# EAGLE design SFD-V1 (EAGLE 9.5.2)
SFD-V1-Dekoder für Selectrix
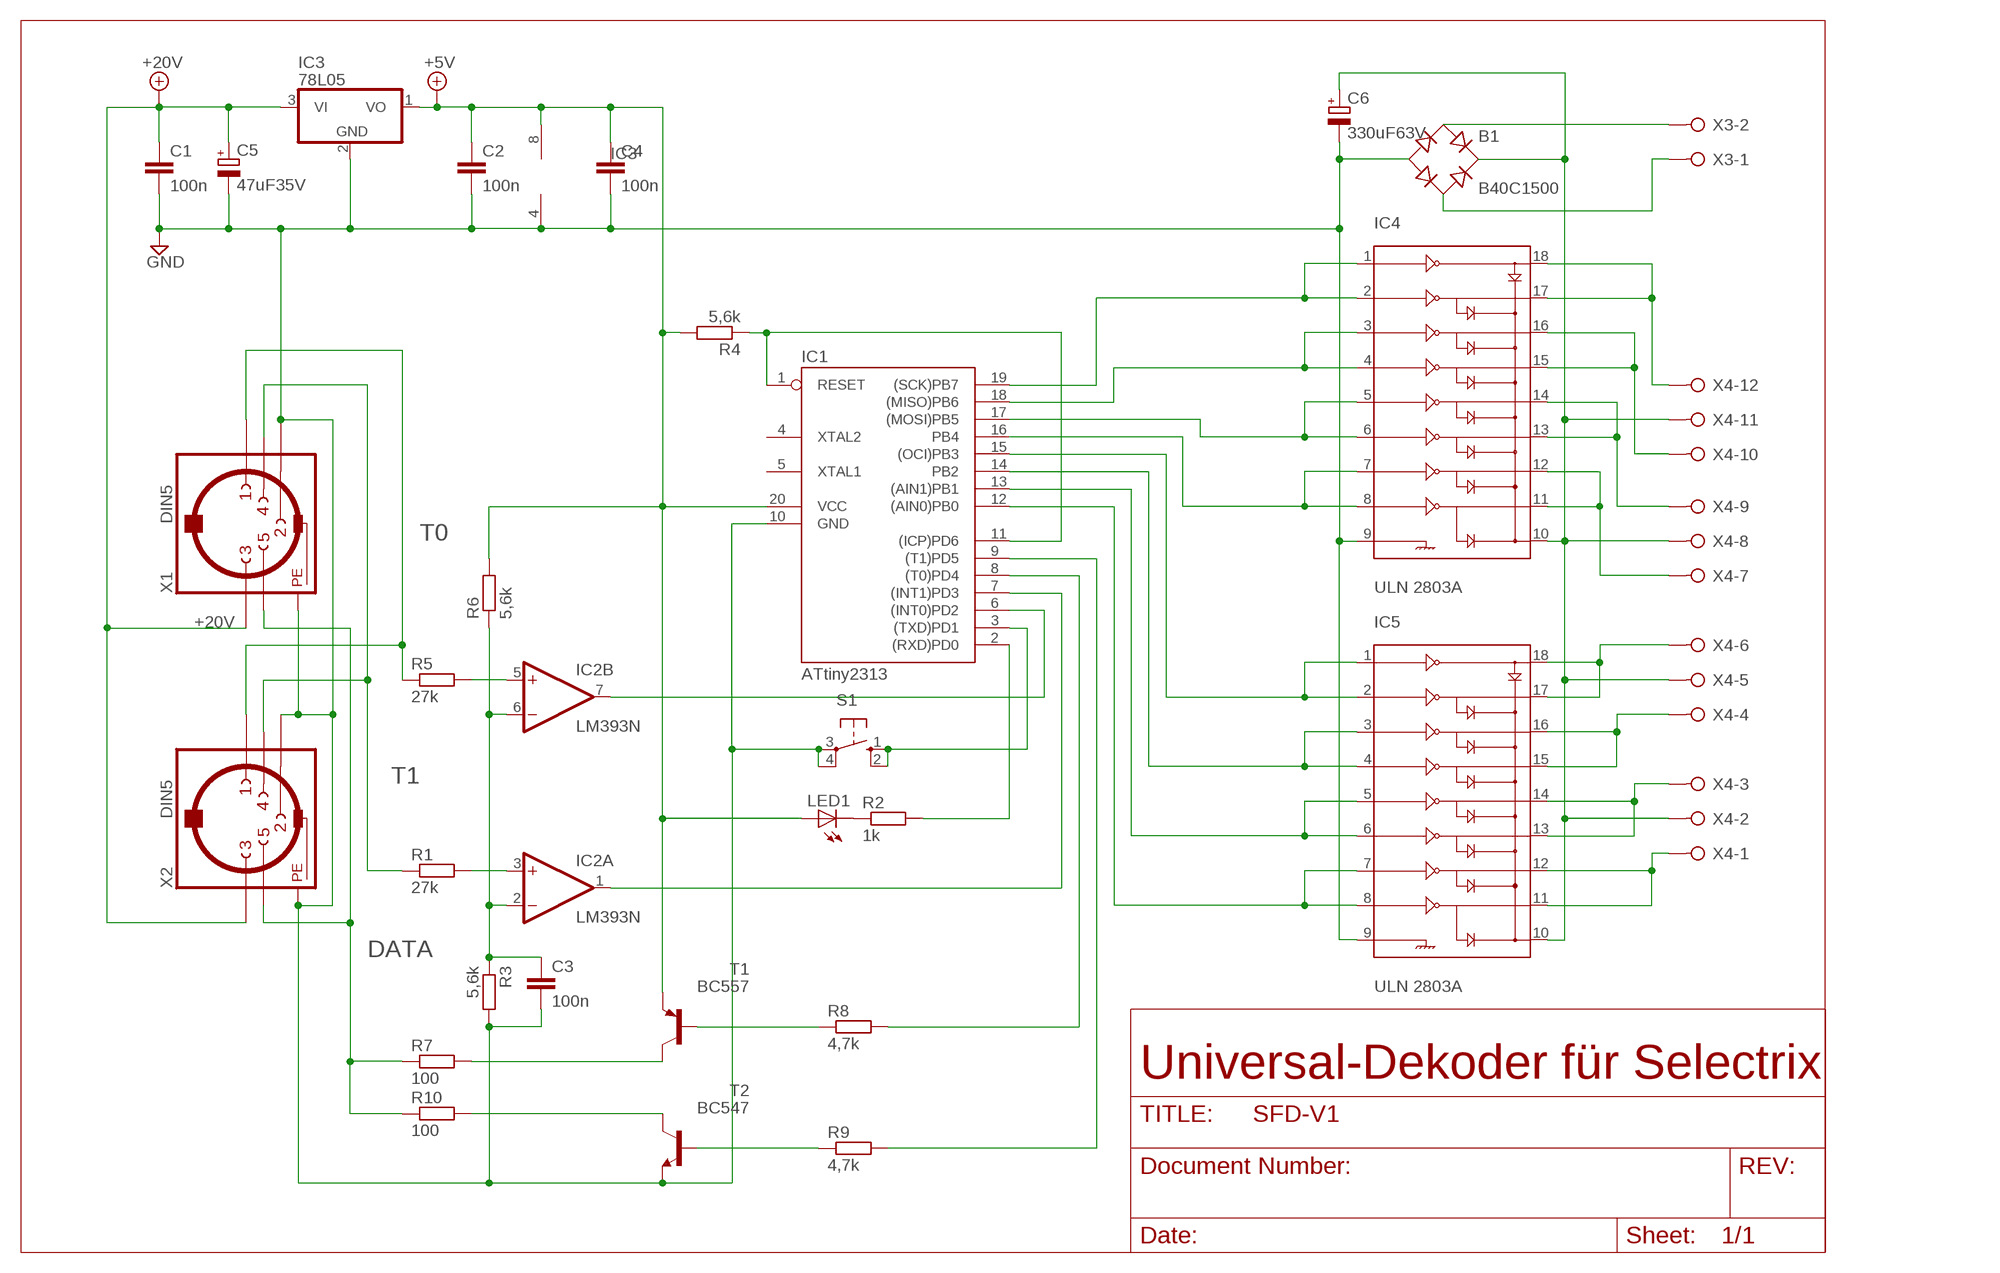
[diagram p0: schematic, sheet 1]

## Parts
B1  B40C1500  RECTIFIER-RB1A  [RB1A]
C1  100n  C-EU025-025X050  [C025-025X050]
C2  100n  C-EU025-025X050  [C025-025X050]
C3  100n  C-EU025-025X050  [C025-025X050]
C4  100n  C-EU025-025X050  [C025-025X050]
C5  47uF35V  CPOL-EUE2,5-6E  [E2,5-6E]
C6  330uF63V  CPOL-EUE5-13  [E5-13]
IC1  ATtiny2313  AT90S2313P  [DIL20]
IC2  LM393N  [DIL08]
IC3  78L05  78L05Z  [TO92]
IC4  ULN 2803A  ULN2803  [DIL18]
IC5  ULN 2803A  ULN2803  [DIL18]
LED1  LED3MM  [LED3MM]
R1  27k  R-EU_0207/10  [0207/10]
R2  1k  R-EU_0207/10  [0207/10]
R3  5,6k  R-EU_0207/10  [0207/10]
R4  5,6k  R-EU_0207/10  [0207/10]
R5  27k  R-EU_0207/10  [0207/10]
R6  5,6k  R-EU_0207/10  [0207/10]
R7  100  R-EU_0207/10  [0207/10]
R8  4,7k  R-EU_0207/10  [0207/10]
R9  4,7k  R-EU_0207/10  [0207/10]
R10  100  R-EU_0207/10  [0207/10]
S1  10-XX  [B3F-10XX]
T1  BC557  [TO92]
T2  BC547  [TO92]
X1  DIN5  CON-HIRSCHMANN_DIN5  [CON-HIRSCHMANN_DIN5]
X2  DIN5  CON-HIRSCHMANN_DIN5  [CON-HIRSCHMANN_DIN5]
X3  W237-02P  [W237-132]
X4  W237-12P  [W237-12P]

## Nets
2-INT0: IC1.6((INT0)PD2) IC2.7(B:OUT)
4: IC1.7((INT1)PD3) IC2.1(A:OUT)
+5V: C2.1 C4.1 IC1.20(VCC) IC2.8(P:V+) IC3.1(VO) LED1.A R4.2 R6.2 T1.1(E)
+20V: C1.1 C5.+ IC3.3(VI) X1.3 X2.3
DATA: R7.1 R10.1 X1.5 X2.5
GND: B1.- C1.2 C2.2 C3.2 C4.2 C5.- C6.- IC1.10(GND) IC2.4(P:V-) IC3.2(GND) IC4.9 IC5.9 R3.2 S1.3(P) S1.4(P1) T2.1(E) X1.2 X1.PE X1.PE1(PE) X1.PE@1(PE) X1.PE@(PE) X2.2 X2.PE X2.PE1(PE) X2.PE@1(PE) X2.PE@(PE)
N$1: IC1.3((TXD)PD1) S1.1(S) S1.2(S1)
N$2: IC1.8((T0)PD4) R8.2
N$3: B1.AC1 X3.2
N$4: IC2.5(B:+IN) R5.2
N$5: IC2.3(A:+IN) R1.2
N$6: LED1.K(C) R2.1
N$7: C3.1 IC2.2(A:-IN) IC2.6(B:-IN) R3.1 R6.1
N$8: IC1.2((RXD)PD0) R2.2
N$9: IC1.1(RESET) IC1.11((ICP)PD6) R4.1
N$10: IC1.12((AIN0)PB0) IC5.7 IC5.8
N$11: IC1.13((AIN1)PB1) IC5.5 IC5.6
N$12: IC1.14(PB2) IC5.3 IC5.4
N$13: R10.2 T2.3(C)
N$14: IC1.15((OCI)PB3) IC5.1 IC5.2
N$15: B1.AC2 X3.1
N$16: R7.2 T1.3(C)
N$17: IC1.16(PB4) IC4.7 IC4.8
N$18: IC1.17((MOSI)PB5) IC4.5 IC4.6
N$19: IC4.17 IC4.18 X4.12
N$20: IC1.19((SCK)PB7) IC4.1 IC4.2
N$21: IC1.18((MISO)PB6) IC4.3 IC4.4
N$22: B1.+ C6.+ IC4.10 IC5.10 X4.2 X4.5 X4.8 X4.11
N$23: IC1.9((T1)PD5) R9.2
N$24: IC4.15 IC4.16 X4.10
N$25: R8.1 T1.2(B)
N$26: IC4.13 IC4.14 X4.9
N$27: R9.1 T2.2(B)
N$28: IC4.11 IC4.12 X4.7
N$30: IC5.17 IC5.18 X4.6
N$32: IC5.15 IC5.16 X4.4
N$34: IC5.13 IC5.14 X4.3
N$36: IC5.11 IC5.12 X4.1
T0: R5.1 X1.1 X2.1
T1: R1.1 X1.4 X2.4
Unconnected: IC1.4(XTAL2) IC1.5(XTAL1)

## Notes on the sheet
- IC3
- Universal-Dekoder für Selectrix

## Library data of the parts
B1 = rectifier:RECTIFIER-: Rectifier
C1-C4 = rcl:C-EU: CAPACITOR, European symbol
C5 = rcl:CPOL-EU: POLARIZED CAPACITOR, European symbol
C6 = rcl:CPOL-EU: POLARIZED CAPACITOR, European symbol; SPICEPREFIX: C
IC1 = atmel:AT90S2313: MICROCONTROLLER 2 Kbytes FLASH 128 bytes SRAM 128 bytes EEPROM UART; OC_FARNELL: unknown; OC_NEWARK: unknown
IC2 = linear3:LM393: COMPARATOR
IC3 = linear3:78*: Positive VOLTAGE REGULATOR Source: http://cache.national.com/ds/LM/LM78L05.pdf http://www.fairchildsemi.com/ds/LM/LM7805.pdf
IC4 IC5 = transistor-arrays-1:ULN2803: ULN2803- Darlington Array Featuring continious load ratings to 500mA for each of the drivers.
LED1 = led:LED: LED OSRAM: - CHIPLED LG R971, LG N971, LY N971, LG Q971, LY Q971, LO R971, LY R971 LH N974, LH R974 LS Q976, LO Q976, LY Q976 LO Q996 - Hyper CHIPLED LW Q18S LB Q993, LB Q99A, LB R99A - SideLED LS A670, LO A670, LY A670, LG A670, LP A670 LB A673, LV A673, LT A673, LW A673 LH A674 LY A675 LS A676, LA A676, LO A676, LY A676, LW A676 LS A679, LY A679, LG A679 - Hyper Micro SIDELED® LS Y876, LA Y876, LO Y876, LY Y876 LT Y87S - SmartLED LW L88C, LW L88S LB L89C, LB L89S, LG L890 LS L89K, LO L89K, LY L89K LS L896, LA L896, LO L896, LY L896 - TOPLED LS T670, LO T670, LY T670, LG T670, LP T670 LSG T670, LSP T670, LSY T670, LOP T670, LYG T670 LG T671, LOG T671, LSG T671 LB T673, LV T673, LT T673, LW T673 LH T674 LS T676, LA T676, LO T676, LY T676, LB T676, LH T676, LSB T676, LW T676 LB T67C, LV T67C, LT T67C, LS T67K, LO T67K, LY T67K, LW E67C LS E67B, LA E67B, LO E67B, LY E67B, LB E67C, LV E67C, LT E67C LW T67C LS T679, LY T679, LG T679 LS T770, LO T770, LY T770, LG T770, LP T770 LB T773, LV T773, LT T773, LW T773 LH T774 LS E675, LA E675, LY E675, LS T675 LS T776, LA T776, LO T776, LY T776, LB T776 LHGB T686 LT T68C, LB T68C - Hyper Mini TOPLED® LB M676 - Mini TOPLED Santana® LG M470 LS M47K, LO M47K, LY M47K Source: http://www.osram.convergy.de LUXEON: - LUMILED® LXK2-PW12-R00, LXK2-PW12-S00, LXK2-PW14-U00, LXK2-PW14-V00 LXK2-PM12-R00, LXK2-PM12-S00, LXK2-PM14-U00 LXK2-PE12-Q00, LXK2-PE12-R00, LXK2-PE12-S00, LXK2-PE14-T00, LXK2-PE14-U00 LXK2-PB12-K00, LXK2-PB12-L00, LXK2-PB12-M00, LXK2-PB14-N00, LXK2-PB14-P00, LXK2-PB14-Q00 LXK2-PR12-L00, LXK2-PR12-M00, LXK2-PR14-Q00, LXK2-PR14-R00 LXK2-PD12-Q00, LXK2-PD12-R00, LXK2-PD12-S00 LXK2-PH12-R00, LXK2-PH12-S00 LXK2-PL12-P00, LXK2-PL12-Q00, LXK2-PL12-R00 Source: www.luxeon.com KINGBRIGHT: KA-3528ASYC Source: www.kingbright.com
R1-R10 = rcl:R-EU_: RESISTOR, European symbol
S1 = switch-omron:10-XX: OMRON SWITCH; MPN: B3F-1000; OC_FARNELL: 176432; OC_NEWARK: 36M3542
T1 = transistor-pnp:BC557: PNP Transistor
T2 = transistor:BC547: NPN TRANSISTOR
X1 X2 = DIN5:CON-HIRSCHMANN_DIN5
X3 = con-wago-508:W237-02P: WAGO SREW CLAMP; OC_FARNELL: unknown; OC_NEWARK: unknown
X4 = con-wago-508:W237-12P: WAGO SREW CLAMP; OC_FARNELL: unknown; OC_NEWARK: unknown

## Board
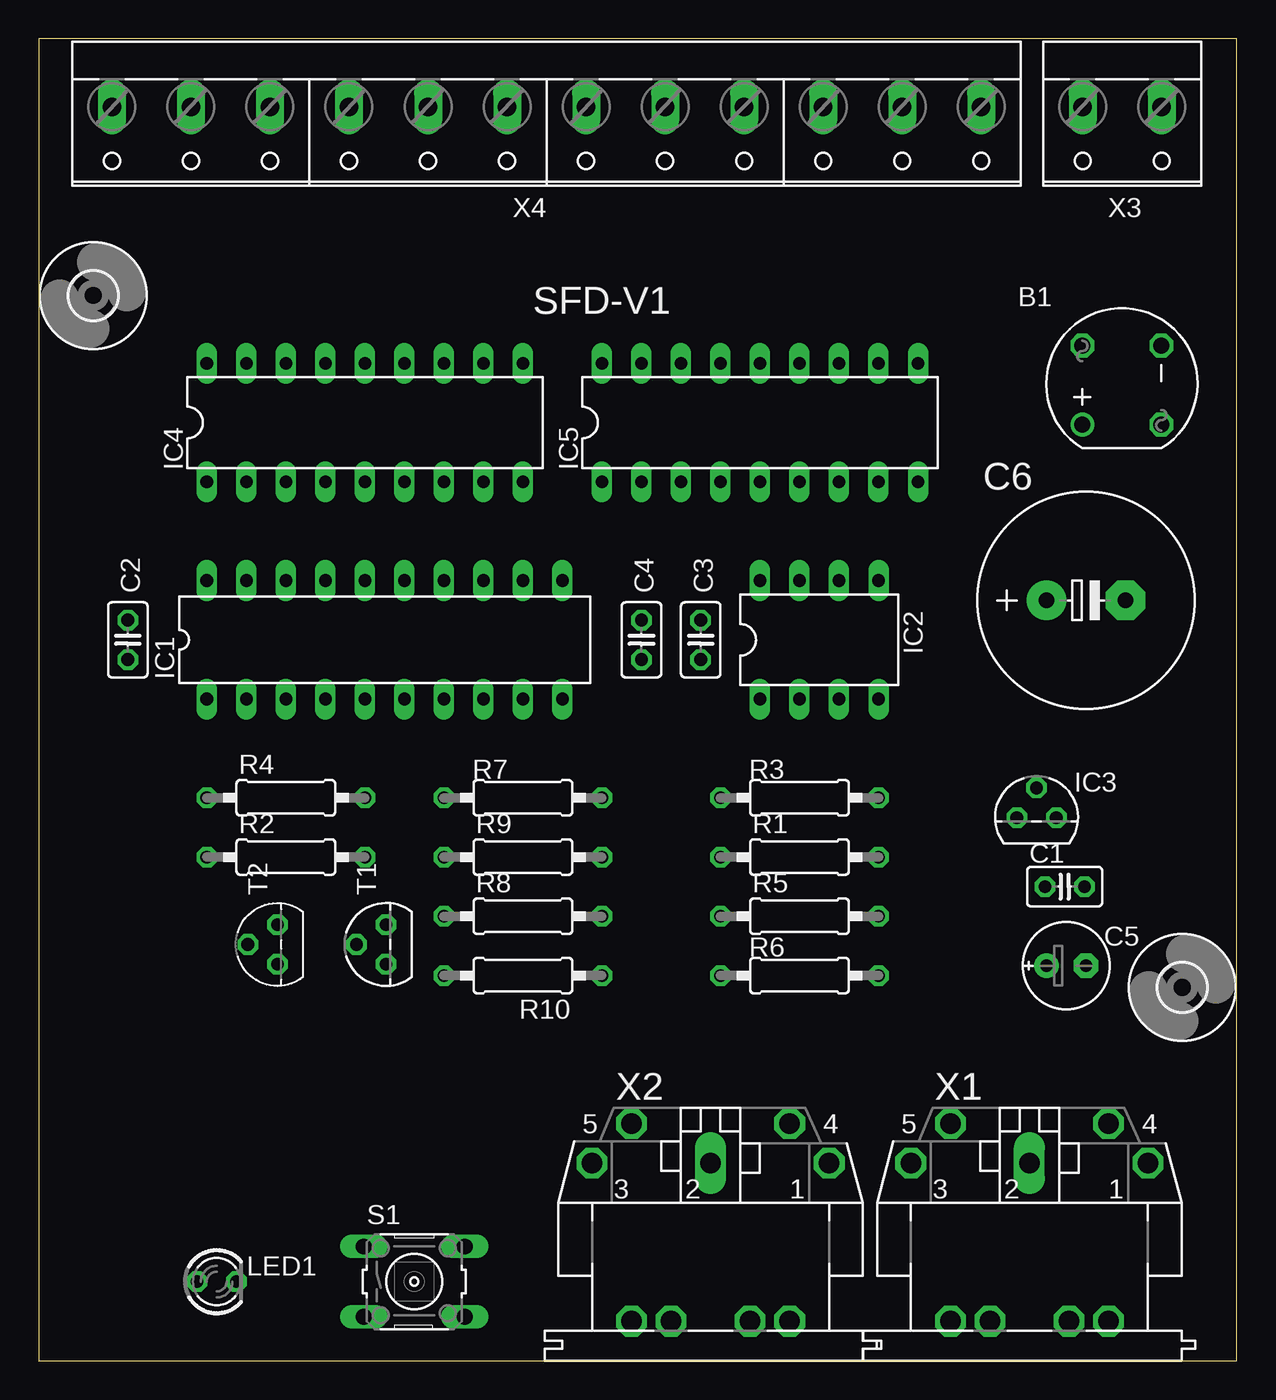
[diagram p1: board, top side]
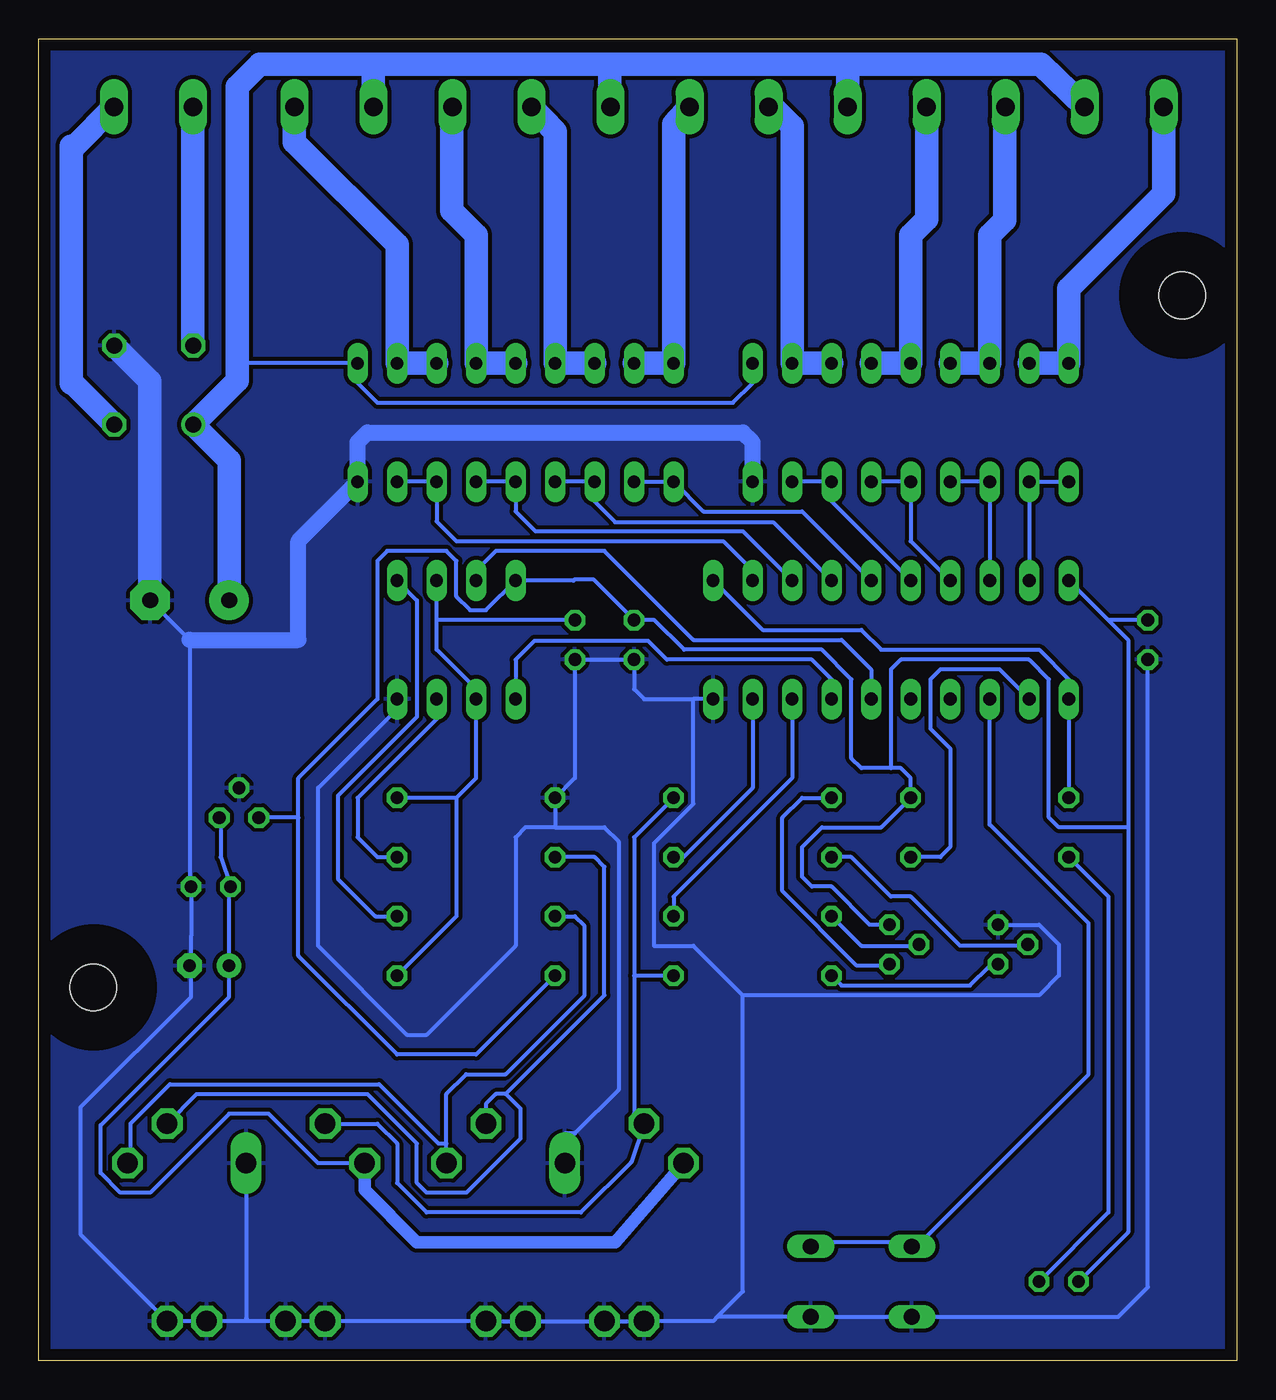
[diagram p2: board, bottom side, seen from below]

Size 77 x 85 mm. Coordinates in mm from the lower left corner, seen from the top.
Outline: 0,85 0,0 77,0 77,85 0,85
Copper layers (1*16): Top 0.035mm / dielectric 1mm / Bottom 0.035mm
Design rules "default *": minimum track width 10mil, minimum drill 0.35mm, track to track 10mil, track to pad 6mil, pad to pad 6mil, via to via 6mil, smd to smd 6mil, copper to edge 30mil, drill to drill 6mil, minimum pad ring 10mil, minimum via ring 8mil, stop-mask expansion 4mil, vias tented up to drill 0mil, thermal gap 10mil

### Footprints (pad centres in the part's own frame; a part is rotated, then mirrored left to right if it is on the bottom)
RB1A = drill 1.016: + -2.54,2.54 | drill 1.016 octagon: - 2.54,-2.54; AC1 2.54,2.54; AC2 -2.54,-2.54
C025-025X050 = drill 0.813 octagon: 1 -1.27,0; 2 1.27,0
E2,5-6E = drill 0.813 pad 1.575: + -1.27,0 | drill 0.813 pad 1.575 octagon: - 1.27,0
E5-13 = drill 1.016 pad 2.54: + -2.54,0 | drill 1.016 pad 2.54 octagon: - 2.54,0
DIL20 = drill 0.813 long: 1 -11.43,-3.81; 2 -8.89,-3.81; 3 -6.35,-3.81; 4 -3.81,-3.81; 5 -1.27,-3.81; 6 1.27,-3.81; 7 3.81,-3.81; 8 6.35,-3.81; 9 8.89,-3.81; 10 11.43,-3.81; 11 11.43,3.81; 12 8.89,3.81; 13 6.35,3.81; 14 3.81,3.81; 15 1.27,3.81; 16 -1.27,3.81; 17 -3.81,3.81; 18 -6.35,3.81; 19 -8.89,3.81; 20 -11.43,3.81
DIL08 = drill 0.813 long: 1 -3.81,-3.81; 2 -1.27,-3.81; 3 1.27,-3.81; 4 3.81,-3.81; 5 3.81,3.81; 6 1.27,3.81; 7 -1.27,3.81; 8 -3.81,3.81
TO92 = drill 0.813 octagon: 1 -1.27,0; 2 0,1.905; 3 1.27,0
DIL18 = drill 0.813 long: 1 -10.16,-3.81; 2 -7.62,-3.81; 3 -5.08,-3.81; 4 -2.54,-3.81; 5 0,-3.81; 6 2.54,-3.81; 7 5.08,-3.81; 8 7.62,-3.81; 9 10.16,-3.81; 10 10.16,3.81; 11 7.62,3.81; 12 5.08,3.81; 13 2.54,3.81; 14 0,3.81; 15 -2.54,3.81; 16 -5.08,3.81; 17 -7.62,3.81; 18 -10.16,3.81
LED3MM = drill 0.813 octagon: A -1.27,0; K 1.27,0
0207/10 = drill 0.813 octagon: 1 -5.08,0; 2 5.08,0
B3F-10XX = drill 1.016 long: 1 -3.251,2.261; 2 3.251,2.261; 3 -3.251,-2.261; 4 3.251,-2.261
TO92' = drill 0.813 octagon: 1 1.27,0; 2 0,1.905; 3 -1.27,0
3,0 = hole 3: 0,0
CON-HIRSCHMANN_DIN5 = drill 1.321 octagon: 1 7.62,6.35; 3 -7.62,6.35; 4 5.08,8.89; 5 -5.08,8.89; PE -2.54,-3.81; PE1 -5.08,-3.81; PE@ 2.54,-3.81; PE@1 5.08,-3.81 | drill 1.321 long: 2 0,6.35
W237-132 = drill 1.194 long: 1 -2.54,-0.635; 2 2.54,-0.635
W237-12P = drill 1.194 long: 1 -27.94,-0.635; 2 -22.86,-0.635; 3 -17.78,-0.635; 4 -12.7,-0.635; 5 -7.62,-0.635; 6 -2.54,-0.635; 7 2.54,-0.635; 8 7.62,-0.635; 9 12.7,-0.635; 10 17.78,-0.635; 11 22.86,-0.635; 12 27.94,-0.635

### Placement (x,y rotation side)
B1  69.62,62.74 90 top
C1  65.94,30.48 0 top
C2  5.71,46.35 270 top
C3  42.55,46.35 270 top
C4  38.73,46.35 270 top
C5  66.04,25.4 0 top
C6  67.31,48.9 0 top
IC1  22.23,46.35 0 top
IC2  50.16,46.35 0 top
IC3  64.14,34.92 0 top
IC4  20.95,60.33 0 top
IC5  46.35,60.33 0 top
LED1  11.43,5.08 0 top
R1  48.9,32.38 0 top
R2  15.88,32.38 0 top
R3  48.9,36.2 180 top
R4  15.88,36.2 0 top
R5  48.9,28.57 0 top
R6  48.9,24.77 180 top
R7  31.11,36.2 180 top
R8  31.11,28.57 0 top
R9  31.11,32.38 0 top
R10  31.11,24.77 180 top
S1  24.13,5.08 0 top
T1  BC557  [TO92']  22.32,26.77 90 top
T2  BC547  [TO92']  15.34,26.77 90 top
U$1  [3,0]  3.5,68.5 0 top
U$2  [3,0]  73.5,24 0 top
X1  63.68,6.35 0 top
X2  43.18,6.35 0 top
X3  69.64,80 180 top
X4  32.63,80 180 top

### Tracks (layer width: path | path; a pad name or v marks a point on that pad's centre or on a via)
2-INT0
  Bottom 0.254: IC1.6 23.5,44.45 25.4,46.35 34.92,46.35 40.64,52.07 47.62,52.07 48.9,50.8 IC2.7
4
  Bottom 0.254: IC2.1 46.35,45.09 45.15,46.29 37.84,46.29 36.63,45.09 27.3,45.09 26.04,43.81 IC1.7
+5V
  Bottom 0.254: LED1.A 6.99,8.26 6.99,34.29 | 6.99,34.29 6.99,46.35 8.26,47.62 | 8.26,47.62 IC1.20 | R6.2 48.9,19.68 53.98,19.68 60.33,26.04 60.33,34.92 | 60.33,34.92 60.33,37.47 55.24,42.55 55.24,51.44 54.61,52.07 50.8,52.07 50.16,51.44 50.16,49.15 49.28,48.26 48.26,48.26 IC2.8 42.63,50.16 42.59,50.22 41.33,50.22 C4.1 37.43,47.62 35.53,45.72 26.67,45.72 24.77,43.81 24.77,38.73 24.13,38.1 22.23,38.1 | 22.23,38.1 21.59,38.1 20.95,37.47 R4.2 22.86,34.29 26.67,34.29 27.94,33.02 27.94,31.11 27.3,30.48 26.04,30.48 23.59,28.04 T1.1 | 6.99,34.29 11.43,34.29 12.06,34.92 12.06,43.81 13.34,45.09 21.59,45.09 22.23,44.45 22.23,38.1 | C2.1 8.26,47.62 | 60.33,34.92 IC3.1
+20V
  Bottom 0.254: IC3.3 65.31,34.83 65.31,32.38 C1.1 64.77,30.48 C5.+ 64.77,23.4 73.03,15.14 73.03,12.06 71.75,10.79 69.85,10.79 64.77,15.88 62.23,15.88 59.05,12.7 X1.3
  Bottom 0.813: X2.3 39.96,7.62 52.7,7.62 56.06,10.97 X1.3
DATA
  Bottom 0.254: R7.1 38.73,33.66 38.73,24.77 | X1.5 55.24,15.24 53.98,13.97 53.98,11.43 52.07,9.53 42.16,9.53 38.92,12.76 X2.5 38.73,15.88 38.73,24.77 | 38.73,24.77 R10.1
GND
  Bottom 0.254: 34.92,42.55 38.1,42.55 38.73,43.18 C4.2 C3.2 42.55,37.47 R3.2 43.81,34.29 | 34.92,42.55 34.92,35.81 37.47,33.27 37.47,26.67 34.92,26.67 31.75,23.5 | 43.81,34.29 40.64,34.29 39.73,33.38 39.73,17.42 42.55,14.61 43.18,14.61 X2.2 | 43.81,34.29 45.72,34.29 46.35,33.66 46.35,26.67 52.07,20.95 53.34,20.95 59.05,26.67 59.05,36.83 53.98,41.91 IC2.4 | 33.38,2.82 31.75,4.45 31.75,23.5 | 63.5,2.54 X1.PE X1.PE1 X2.PE@1 X2.PE@ X2.PE X2.PE1 33.66,2.54 33.38,2.82 | 63.5,2.54 X1.PE@ X1.PE@1 74.3,8.08 74.3,16.32 67.22,23.39 67.22,27.28 67.22,27.3 C1.2 67.31,30.49 67.31,46.35 C6.- | 33.38,2.82 S1.4 S1.3 7.62,2.82 5.71,4.72 C2.2 | X1.2 63.68,2.72 63.5,2.54 | T2.1 12.7,28.04 11.43,26.77 11.43,24.77 12.7,23.5 31.75,23.5 | IC1.10 34.92,42.55
  Bottom 1.016: 67.31,46.35 60.33,46.35 60.33,52.7 IC5.9 56.52,59.05 55.88,59.69 31.75,59.69 31.11,59.05 IC4.9
  Bottom 1.524: B1.- 69.88,62.99 69.88,48.92 C6.-
  pour Bottom: 0,0 0,85 77,85 77,0
N$1
  Bottom 0.254: IC1.3 15.88,34.48 9.53,28.13 9.53,18.41 20.32,7.62 S1.1 20.95,7.62 27.3,7.62 S1.2
N$2
  Bottom 0.254: IC1.8 28.57,37.47 36.2,29.84 R8.2
N$3
  Bottom 1.016: 67.09,65.29 B1.AC1
  Bottom 1.524: 67.09,65.29 X3.2
N$4
  Bottom 0.254: IC2.5 52.7,48.9 52.7,41.4 57.78,36.32 57.78,30.99 55.37,28.57 R5.2
N$5
  Bottom 0.254: IC2.3 51.44,41.27 56.52,36.2 56.52,33.66 55.24,32.38 R1.2
N$6
  Bottom 0.254: LED1.K 8.26,9.53 8.26,29.84 R2.1
N$7
  Bottom 0.254: R6.1 50.16,28.57 50.16,36.2 | 50.16,36.2 R3.1 | 51.44,47.62 IC2.6 | C3.1 51.44,47.62 | 51.44,47.62 51.44,45.72 48.9,43.18 IC2.2 48.9,37.47 50.16,36.2
N$8
  Bottom 0.254: IC1.2 15.24,44.45 19.05,44.45 19.68,43.81 19.68,40.64 18.41,39.37 18.41,33.02 19.05,32.38 20.32,32.38 20.64,32.7 R2.2
N$9
  Bottom 0.254: R4.1 IC1.1 10.79,43.81 12.7,45.72 22.86,45.72 24.13,46.99 30.48,46.99 IC1.11
N$10
  Bottom 0.254: IC5.8 IC5.7 51.44,53.98 50.16,52.7 33.02,52.7 31.11,50.8 IC1.12
N$11
  Bottom 0.254: IC1.13 31.75,53.34 45.09,53.34 46.35,54.61 IC5.5 IC5.6
N$12
  Bottom 0.254: IC1.14 29.79,53.92 39.95,53.92 41.27,55.24 IC5.3 IC5.4
N$13
  Bottom 0.254: R10.2 25.4,24.13 17.14,24.13 15.88,25.4 T2.3
N$14
  Bottom 0.254: IC1.15 27.94,54.61 34.29,54.61 IC5.1 IC5.2
N$15
  Bottom 1.524: B1.AC2 74.83,62.87 74.93,62.87 74.93,78.11 74.7,78.11 X3.1
N$16
  Bottom 0.254: T1.3 22.41,25.4 24.41,25.4 29.21,30.2 29.21,34.92 27.94,36.2 R7.2
N$17
  Bottom 0.254: IC1.16 26.04,55.24 IC4.7 IC4.8
N$18
  Bottom 0.254: IC1.17 20.95,52.7 IC4.5 IC4.6
N$19
  Bottom 1.524: IC4.17 IC4.18 10.79,68.94 4.7,75.05 X4.12
N$20
  Bottom 0.254: IC1.19 IC4.2 IC4.1
N$21
  Bottom 0.254: IC1.18 IC4.3 IC4.4
N$22
  Bottom 0.254: 64.26,64.14 IC5.10 56.52,62.87 55.24,61.59 32.38,61.59 31.11,62.87 IC4.10
  Bottom 1.016: X4.5 40.31,80.59 | 25.02,82.8 25.58,83.36 | 55.49,82.98 55.88,83.36
  Bottom 1.524: C6.+ 64.77,57.89 B1.+ 64.26,63.02 64.26,64.14 64.26,81.92 62.81,83.36 55.88,83.36 40.31,83.36 | 40.31,80.59 40.31,83.36 | X4.8 25.02,82.8 | X4.11 12.6,83.36 25.58,83.36 40.31,83.36 | X4.2 55.49,82.98
N$23
  Bottom 0.254: IC1.9 31.11,36.83 35.56,32.38 R9.2
N$24
  Bottom 1.016: 14.91,80.48 X4.10
  Bottom 1.524: 14.91,80.48 14.91,73.36 15.88,72.39 IC4.16 IC4.15
N$25
  Bottom 0.254: R8.1 24.13,26.67 20.95,26.67 T1.2
N$26
  Bottom 1.016: 19.94,80.54 X4.9
  Bottom 1.524: 19.94,80.54 19.94,73.41 20.95,72.39 IC4.14 IC4.13
N$27
  Bottom 0.254: T2.2 13.53,26.67 17.78,26.67 20.95,29.84 22.23,29.84 24.77,32.38 R9.1
N$28
  Bottom 1.016: 29.74,80.54 X4.7
  Bottom 1.524: 29.74,80.54 28.57,79.38 IC4.11 IC4.12
N$30
  Bottom 1.524: IC5.17 IC5.18 36.2,79.52 X4.6
N$32
  Bottom 1.524: IC5.16 IC5.15 43.81,79.02 X4.4
N$34
  Bottom 1.016: 50.47,80.48 X4.3
  Bottom 1.524: IC5.14 IC5.13 48.9,72.39 50.47,73.97 50.47,80.48
N$36
  Bottom 1.524: IC5.12 IC5.11 53.98,71.75 60.58,78.36 X4.1
T0
  Bottom 0.254: R5.1 42.55,28.57 41.91,27.94 41.91,23.5 46.99,18.41 49.53,18.41 50.8,17.14 50.8,13.97 | X2.1 50.8,13.97 | X1.1 71.12,12.88 71.12,15.24 68.58,17.78 55.13,17.78 51.33,13.97 50.8,13.97
T1
  Bottom 0.254: R1.1 41.27,32.38 40.64,31.75 40.64,23.5 46.99,17.14 | 46.99,17.14 47.62,17.14 48.26,16.51 X2.4 | X1.4 66.85,17.14 55.88,17.14 52.7,13.97 52.7,11.43 52.07,10.79 49.53,10.79 46.04,14.29 46.04,16.19 46.99,17.14

### Text on the board
tNames: SFD-V1